# Altium schematic sheet [14] - BOT BOARD HEADER.SchDoc
size A4; DocumentNumber: 14; SheetNumber: 14; SheetTotal: 14
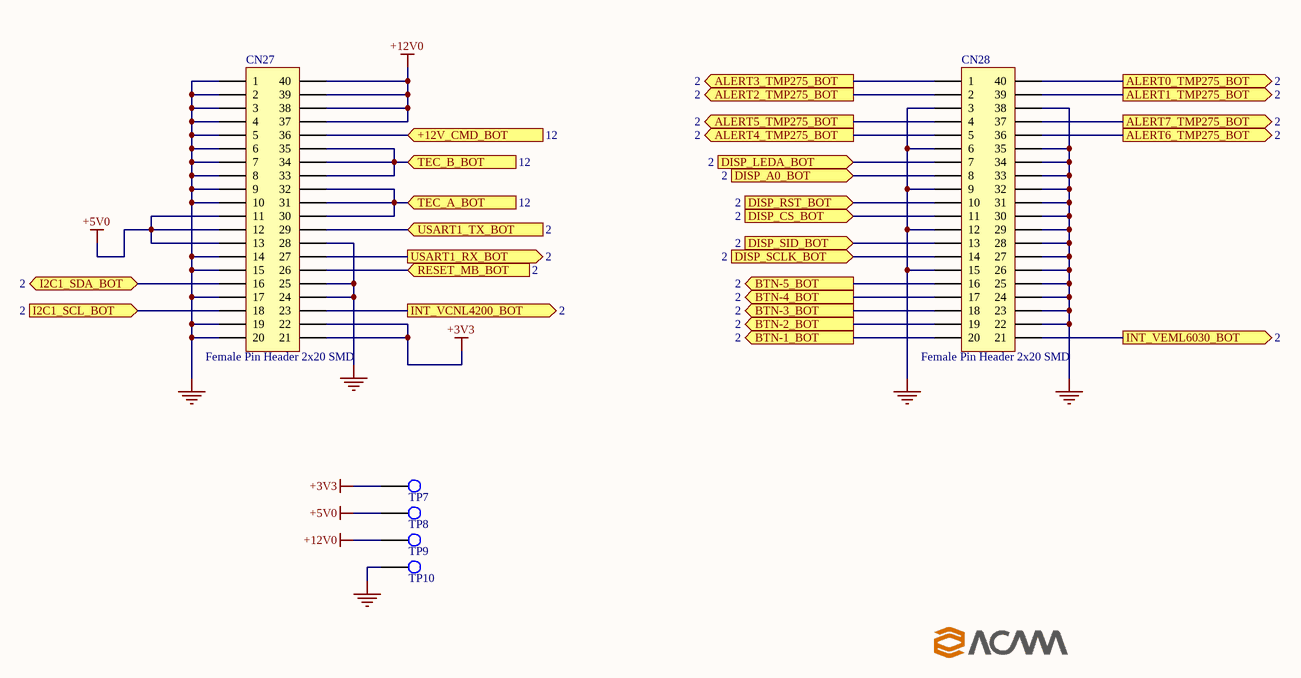
[diagram p0: [14] - BOT BOARD HEADER.SchDoc]

## Parts
CN27  Female Pin Header 2x20 SMD  [HEADER_FEMALE_SMD_2x20]
CN28  Female Pin Header 2x20 SMD  [HEADER_FEMALE_SMD_2x20]
TP7  Test Point  [PIN_2mm]  (value not drawn)
TP8  Test Point  [PIN_2mm]  (value not drawn)
TP9  Test Point  [PIN_2mm]  (value not drawn)
TP10  Test Point  [PIN_2mm]  (value not drawn)

## Ports
+12V_CMD_BOT (in, see 12), ALERT0_TMP275_BOT (out, see 2), ALERT1_TMP275_BOT (out, see 2), ALERT2_TMP275_BOT (out, see 2), ALERT3_TMP275_BOT (out, see 2), ALERT4_TMP275_BOT (out, see 2), ALERT5_TMP275_BOT (out, see 2), ALERT6_TMP275_BOT (out, see 2), ALERT7_TMP275_BOT (out, see 2), BTN-1_BOT (out, see 2), BTN-2_BOT (out, see 2), BTN-3_BOT (out, see 2), BTN-4_BOT (out, see 2), BTN-5_BOT (out, see 2), DISP_A0_BOT (in, see 2), DISP_CS_BOT (in, see 2), DISP_LEDA_BOT (in, see 2), DISP_RST_BOT (in, see 2), DISP_SCLK_BOT (in, see 2), DISP_SID_BOT (in, see 2), I2C1_SCL_BOT (in, see 2), I2C1_SDA_BOT (bidir, see 2), INT_VCNL4200_BOT (out, see 2), INT_VEML6030_BOT (out, see 2), RESET_MB_BOT (in, see 2), TEC_A_BOT (in, see 12), TEC_B_BOT (in, see 12), USART1_RX_BOT (out, see 2), USART1_TX_BOT (in, see 2)

## Nets
+3V3: CN27.21 CN27.22 TP7.1
+5V0: CN27.11 CN27.12 CN27.13 TP8.1
+12V0: CN27.37 CN27.38 CN27.39 CN27.40 TP9.1
GND: CN27.1 CN27.2 CN27.3 CN27.4 CN27.5 CN27.6 CN27.7 CN27.8 CN27.9 CN27.10 CN27.14 CN27.15 CN27.17 CN27.19 CN27.20 CN27.24 CN27.25 CN27.28 CN28.3 CN28.6 CN28.9 CN28.12 CN28.15 CN28.22 CN28.23 CN28.24 CN28.25 CN28.26 CN28.27 CN28.28 CN28.29 CN28.30 CN28.31 CN28.32 CN28.33 CN28.34 CN28.35 CN28.38 TP10.1
+12V_CMD_BOT: CN27.36 ; port +12V_CMD_BOT
ALERT0_TMP275_BOT: CN28.40 ; port ALERT0_TMP275_BOT
ALERT1_TMP275_BOT: CN28.39 ; port ALERT1_TMP275_BOT
ALERT2_TMP275_BOT: CN28.2 ; port ALERT2_TMP275_BOT
ALERT3_TMP275_BOT: CN28.1 ; port ALERT3_TMP275_BOT
ALERT4_TMP275_BOT: CN28.5 ; port ALERT4_TMP275_BOT
ALERT5_TMP275_BOT: CN28.4 ; port ALERT5_TMP275_BOT
ALERT6_TMP275_BOT: CN28.36 ; port ALERT6_TMP275_BOT
ALERT7_TMP275_BOT: CN28.37 ; port ALERT7_TMP275_BOT
BTN-1_BOT: CN28.20 ; port BTN-1_BOT
BTN-2_BOT: CN28.19 ; port BTN-2_BOT
BTN-3_BOT: CN28.18 ; port BTN-3_BOT
BTN-4_BOT: CN28.17 ; port BTN-4_BOT
BTN-5_BOT: CN28.16 ; port BTN-5_BOT
DISP_A0_BOT: CN28.8 ; port DISP_A0_BOT
DISP_CS_BOT: CN28.11 ; port DISP_CS_BOT
DISP_LEDA_BOT: CN28.7 ; port DISP_LEDA_BOT
DISP_RST_BOT: CN28.10 ; port DISP_RST_BOT
DISP_SCLK_BOT: CN28.14 ; port DISP_SCLK_BOT
DISP_SID_BOT: CN28.13 ; port DISP_SID_BOT
I2C1_SCL_BOT: CN27.18 ; port I2C1_SCL_BOT
I2C1_SDA_BOT: CN27.16 ; port I2C1_SDA_BOT
INT_VCNL4200_BOT: CN27.23 ; port INT_VCNL4200_BOT
INT_VEML6030_BOT: CN28.21 ; port INT_VEML6030_BOT
RESET_MB_BOT: CN27.26 ; port RESET_MB_BOT
TEC_A_BOT: CN27.30 CN27.31 CN27.32 ; port TEC_A_BOT
TEC_B_BOT: CN27.33 CN27.34 CN27.35 ; port TEC_B_BOT
USART1_RX_BOT: CN27.27 ; port USART1_RX_BOT
USART1_TX_BOT: CN27.29 ; port USART1_TX_BOT

## Library data of the parts
CN27 CN28 = Pin header Female 2x20 smd: SMD Female Pin Header 2.54mm Pitch, 2x20; System: Connector; Value: Female Pin Header 2x20 SMD
TP7-TP10 = Test Point: Test Point Footprint; Value: Test Point